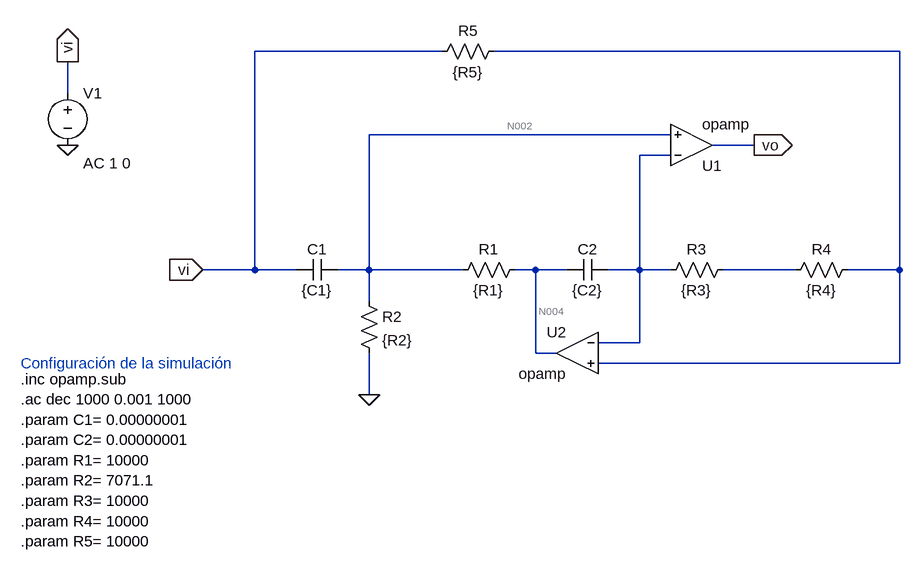
[diagram p0: schematic 20230726 - Ejercicio 1 - item e.asc]
20230726 - Ejercicio 1 - item e.asc, the LTspice schematic file:
Version 4
SHEET 1 880 928
WIRE 144 112 -144 112
WIRE 848 112 224 112
WIRE -432 176 -432 128
WIRE 496 240 32 240
WIRE 624 256 560 256
WIRE 496 272 448 272
WIRE -144 448 -144 112
WIRE -144 448 -224 448
WIRE -80 448 -144 448
WIRE 32 448 32 240
WIRE 32 448 -16 448
WIRE 176 448 32 448
WIRE 288 448 256 448
WIRE 336 448 288 448
WIRE 448 448 448 272
WIRE 448 448 400 448
WIRE 496 448 448 448
WIRE 688 448 576 448
WIRE 848 448 848 112
WIRE 848 448 768 448
WIRE 32 496 32 448
WIRE 448 560 448 448
WIRE 448 560 384 560
WIRE 288 576 288 448
WIRE 320 576 288 576
WIRE 848 592 848 448
WIRE 848 592 384 592
WIRE 32 640 32 576
FLAG 32 640 0
FLAG -224 448 vi
IOPIN -224 448 In
FLAG 624 256 vo
IOPIN 624 256 Out
FLAG -432 256 0
FLAG -432 128 vi
IOPIN -432 128 Out
SYMBOL res 240 96 R90
WINDOW 0 0 56 VBottom 2
WINDOW 3 32 56 VTop 2
SYMATTR InstName R5
SYMATTR Value {R5}
SYMBOL OpAmps\\opamp 528 320 M180
SYMATTR InstName U1
SYMBOL OpAmps\\opamp 352 512 M0
SYMATTR InstName U2
SYMBOL cap -16 432 R90
WINDOW 0 0 32 VBottom 2
WINDOW 3 32 32 VTop 2
SYMATTR InstName C1
SYMATTR Value {C1}
SYMBOL res 16 480 R0
SYMATTR InstName R2
SYMATTR Value {R2}
SYMBOL res 272 432 R90
WINDOW 0 0 56 VBottom 2
WINDOW 3 32 56 VTop 2
SYMATTR InstName R1
SYMATTR Value {R1}
SYMBOL res 592 432 R90
WINDOW 0 0 56 VBottom 2
WINDOW 3 32 56 VTop 2
SYMATTR InstName R3
SYMATTR Value {R3}
SYMBOL res 784 432 R90
WINDOW 0 0 56 VBottom 2
WINDOW 3 32 56 VTop 2
SYMATTR InstName R4
SYMATTR Value {R4}
SYMBOL cap 400 432 R90
WINDOW 0 0 32 VBottom 2
WINDOW 3 32 32 VTop 2
SYMATTR InstName C2
SYMATTR Value {C2}
SYMBOL voltage -432 160 R0
WINDOW 123 24 124 Left 2
WINDOW 39 24 152 Left 2
SYMATTR Value2 AC 1 0
SYMATTR InstName V1
SYMATTR Value ""
TEXT -504 592 Left 2 ;Configuración de la simulación
TEXT -504 616 Left 2 !.inc opamp.sub\n.ac dec 1000 0.001 1000\n.param C1= 0.00000001\n.param C2= 0.00000001\n.param R1= 10000\n.param R2= 7071.1\n.param R3= 10000\n.param R4= 10000\n.param R5= 10000

The netlist it stands for:
* 20230726 - Ejercicio 1 - item e.asc
R5 N001 vi {R5}
XU1 N003 N002 vo opamp Aol=100K GBW=10Meg  ; pins invin noninvin out
XU2 N003 N001 N004 opamp Aol=100K GBW=10Meg  ; pins invin noninvin out
C1 N002 vi {C1}
R2 N002 0 {R2}
R1 N004 N002 {R1}
R3 N005 N003 {R3}
R4 N001 N005 {R4}
C2 N003 N004 {C2}
V1 vi 0 AC 1 0
* Configuración de la simulación
.inc opamp.sub
.ac dec 1000 0.001 1000
.param C1= 0.00000001
.param C2= 0.00000001
.param R1= 10000
.param R2= 7071.1
.param R3= 10000
.param R4= 10000
.param R5= 10000
.backanno
.end

* Results of the author's LTspice run, read from the files saved beside the schematic
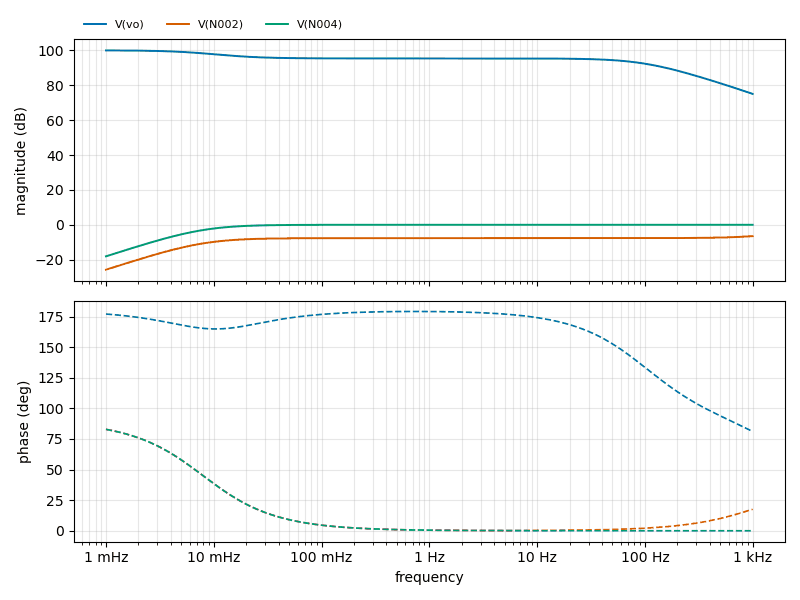
[diagram p1: AC Analysis of 20230726 - Ejercicio 1 - item e.asc, plotted from the saved traces]
* AC Analysis, 1 run:
*   V(vo): 99.96 dB at 1 mHz, 75.03 dB at 1 kHz, peak 99.96 dB at 1 mHz, 3 dB below the peak at 14.52 mHz
*   V(N002): -25.74 dB at 1 mHz, -6.50 dB at 1 kHz, peak -6.50 dB at 1 kHz, 3 dB below the peak at 10.92 mHz
*   V(N004): -18.08 dB at 1 mHz, -0.00 dB at 1 kHz, peak -0.00 dB at 229.6 Hz, 3 dB below the peak at 7.957 mHz